# EasyEDA Pro project FKM3.epro, schematic FKM-standard

## Sheets
1 Main: Board Name: FKM; Create Date: 2024-11-17; Page Name: Main; Project Name: fkm3; Schematic Name: FKM-standard; Update Date: 2025-02-15; Company: EasyEDA.com; Drawn: EasyEDA; Page Size: A4; Part Number: JLCPCB-002; Reviewed: EasyEDA; Version: V3.0
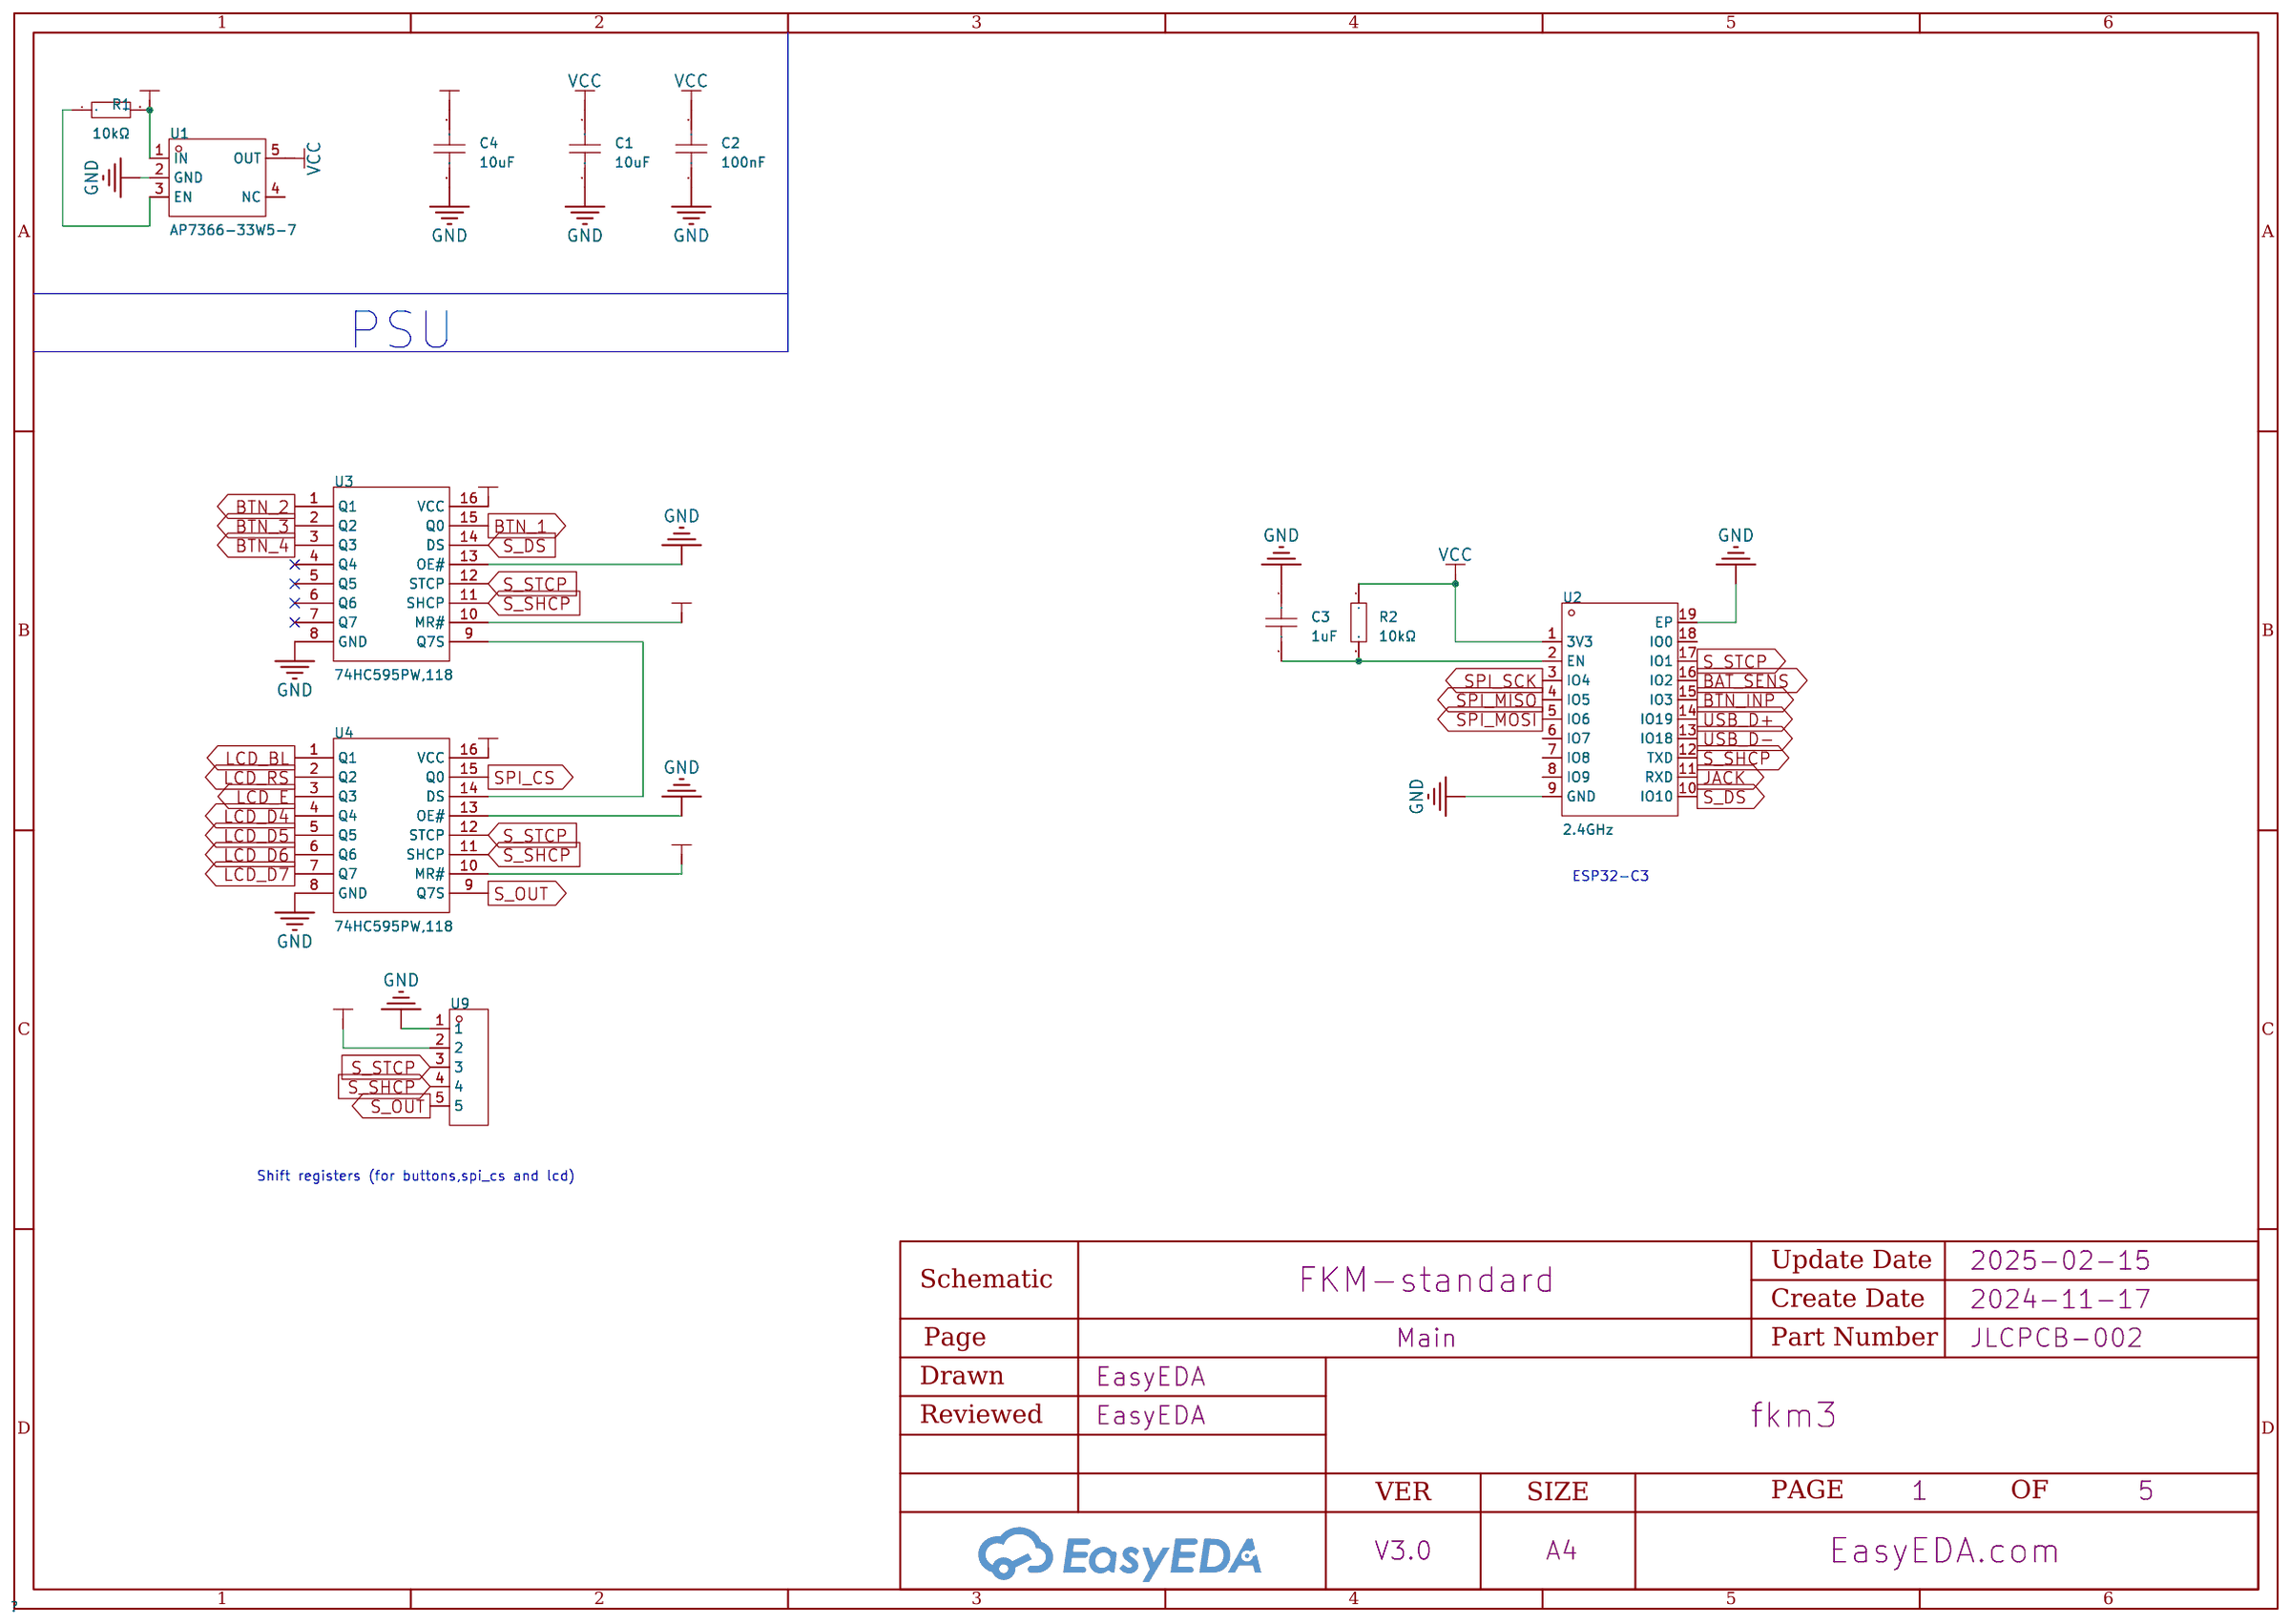
[diagram p3: Main]
2 Peripherals: Create Date: 2024-12-11; Page Name: Peripherals; Version: V0.1
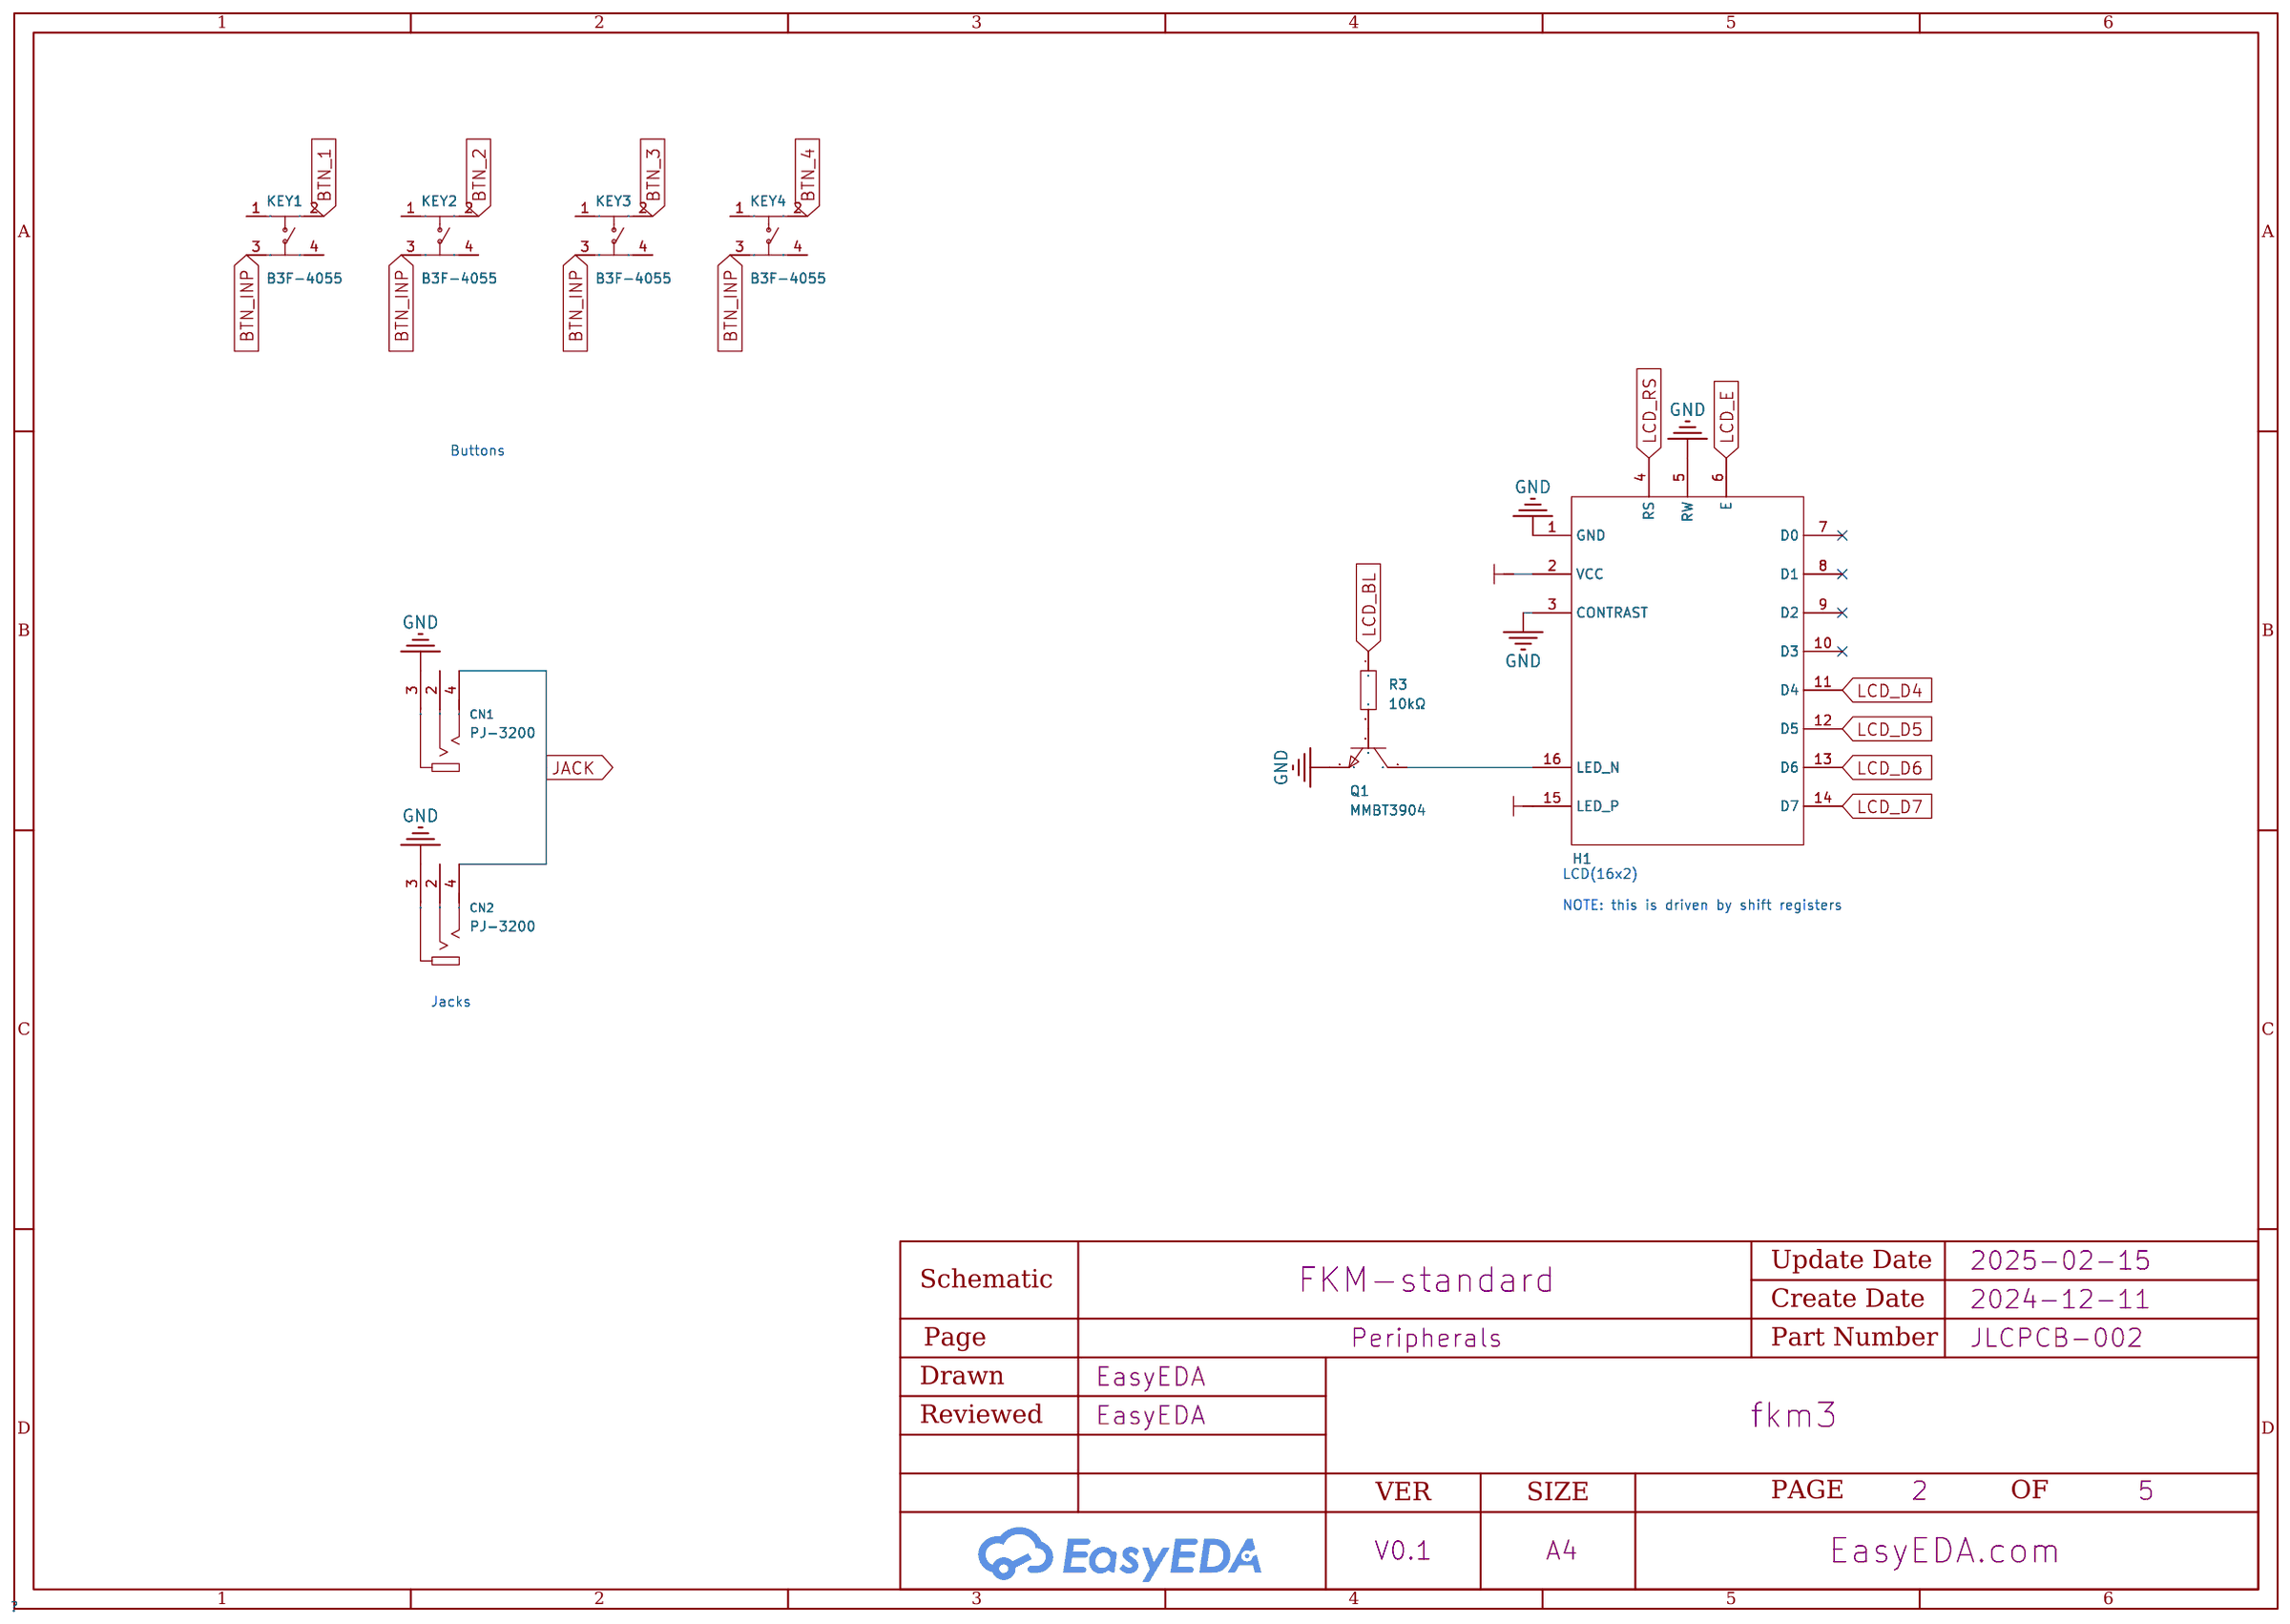
[diagram p4: Peripherals]
3 Charger: Create Date: 2025-01-28; Page Name: Charger; Update Date: 2025-07-09; Version: V0.1
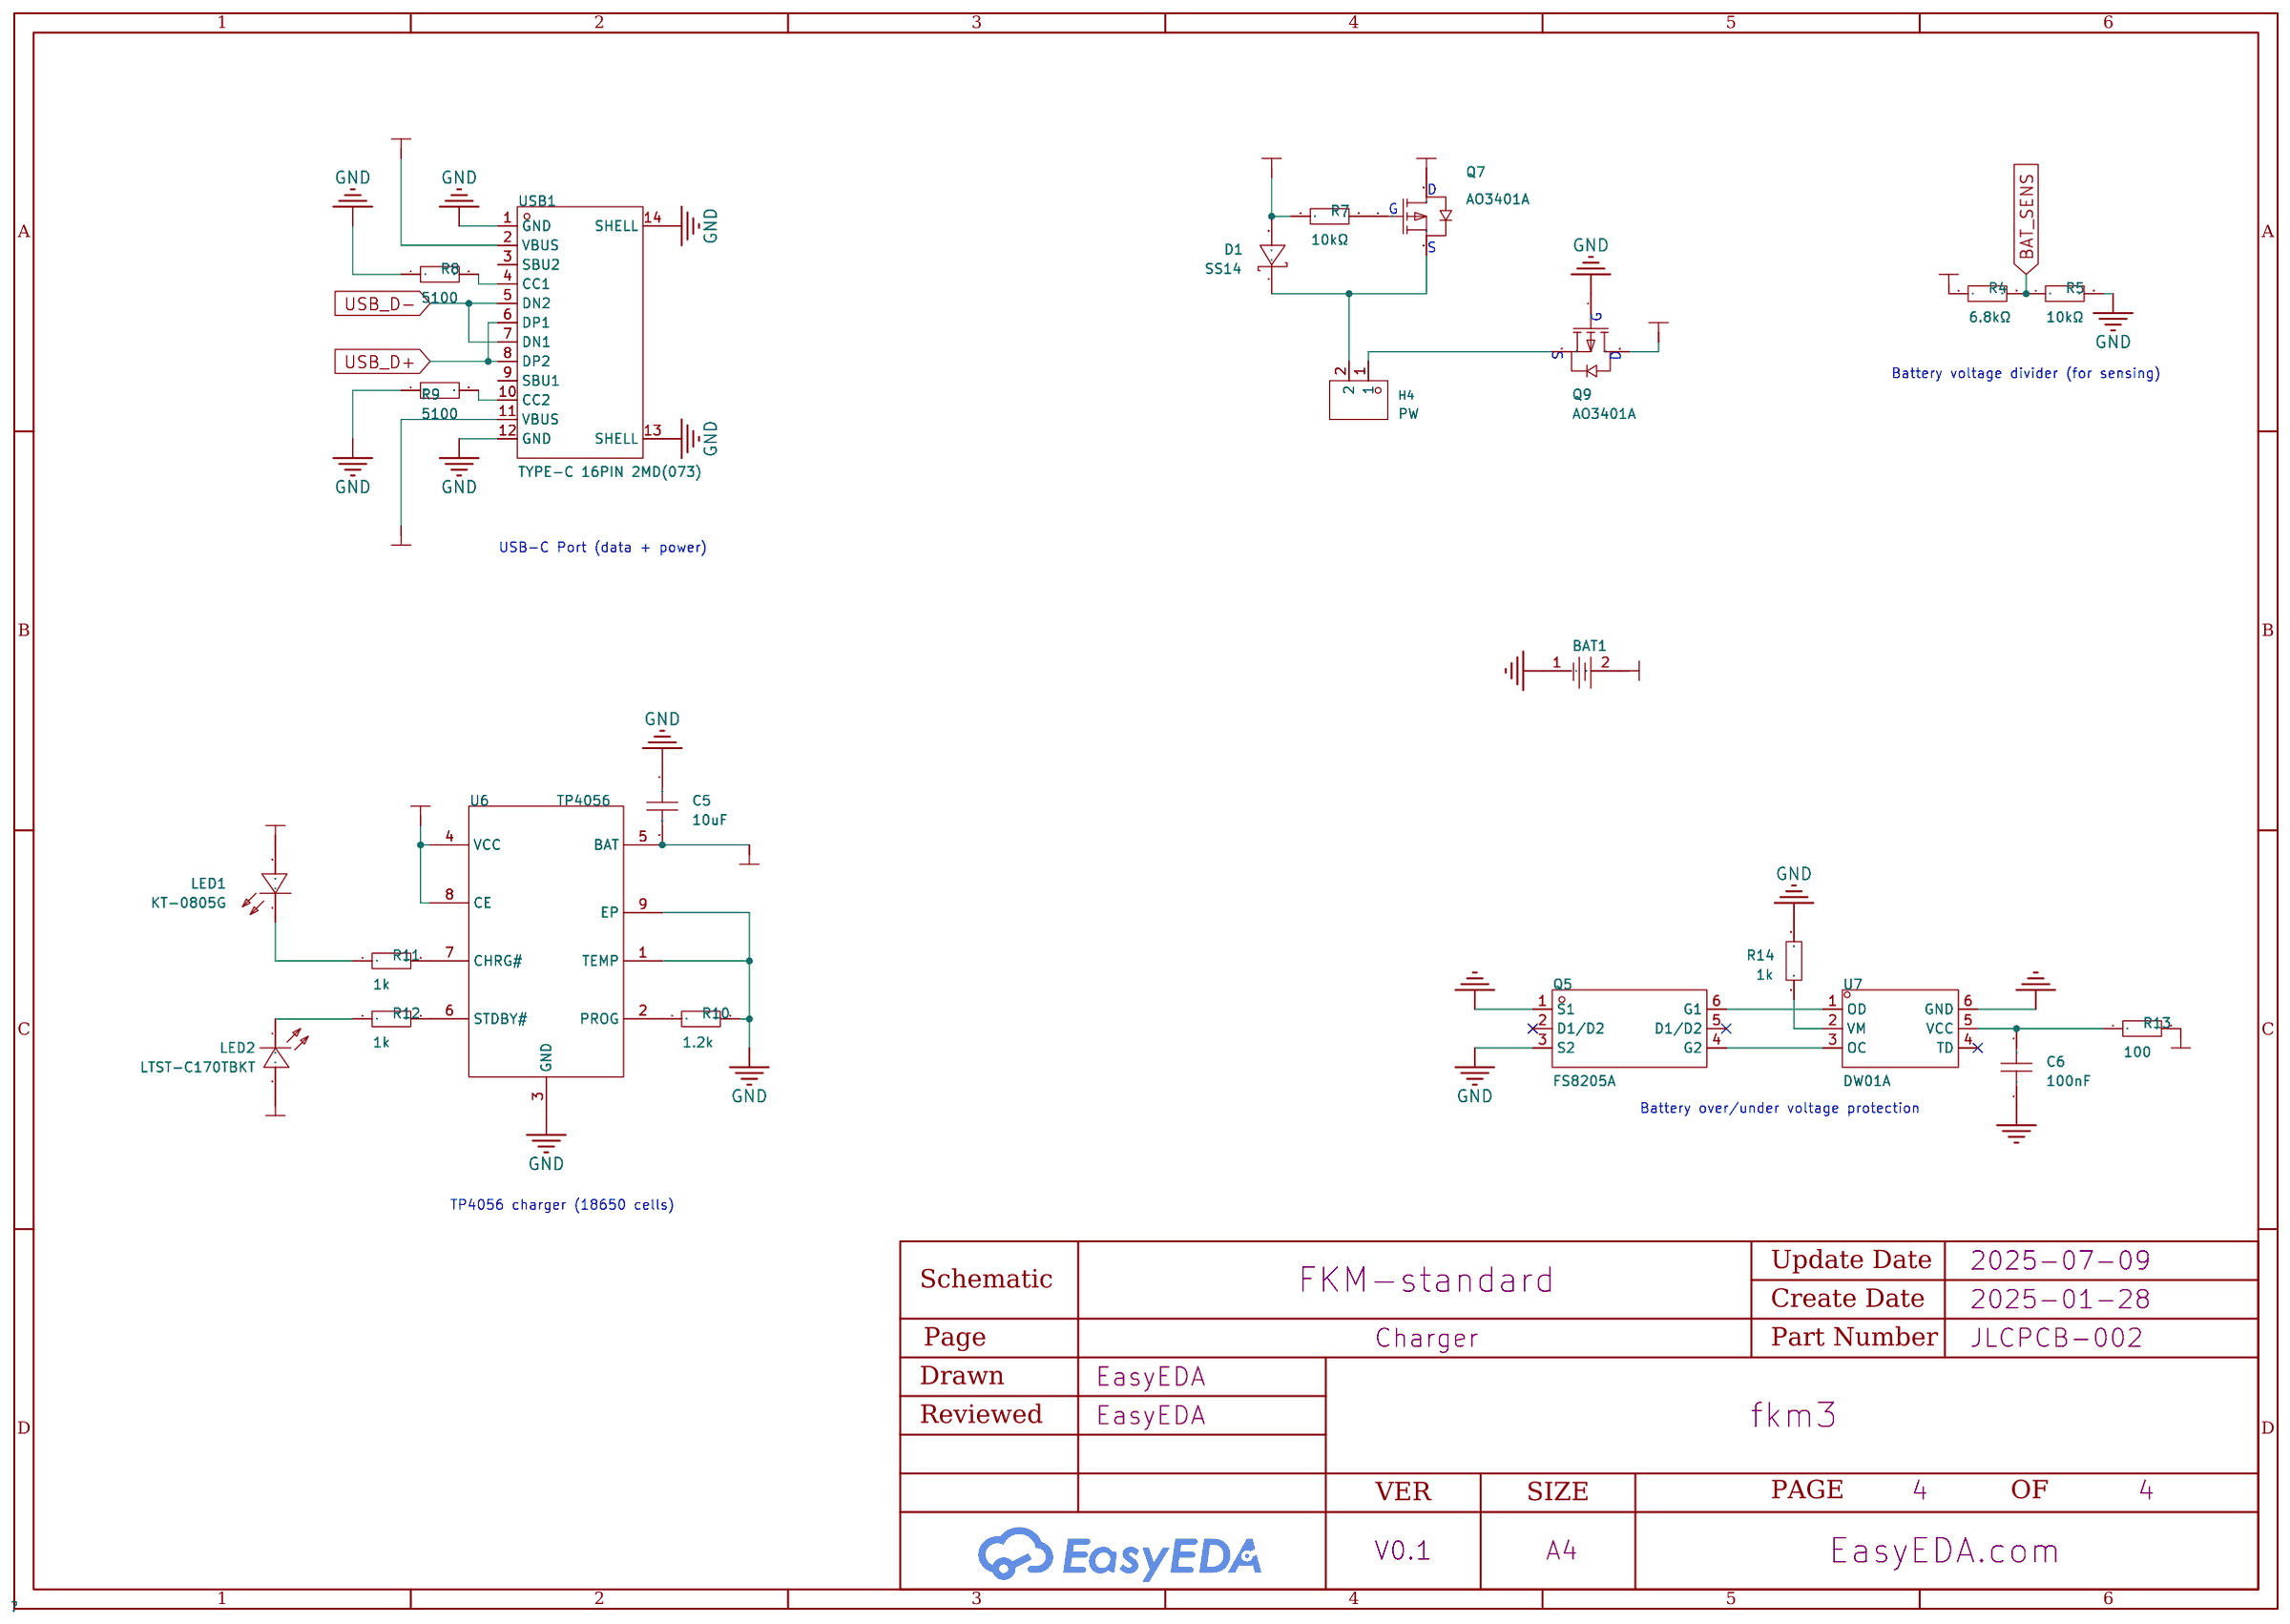
[diagram p5: Charger]
4 RFID: Create Date: 2025-07-08; Page Name: RFID; Update Date: 2025-07-08; Version: V0.1
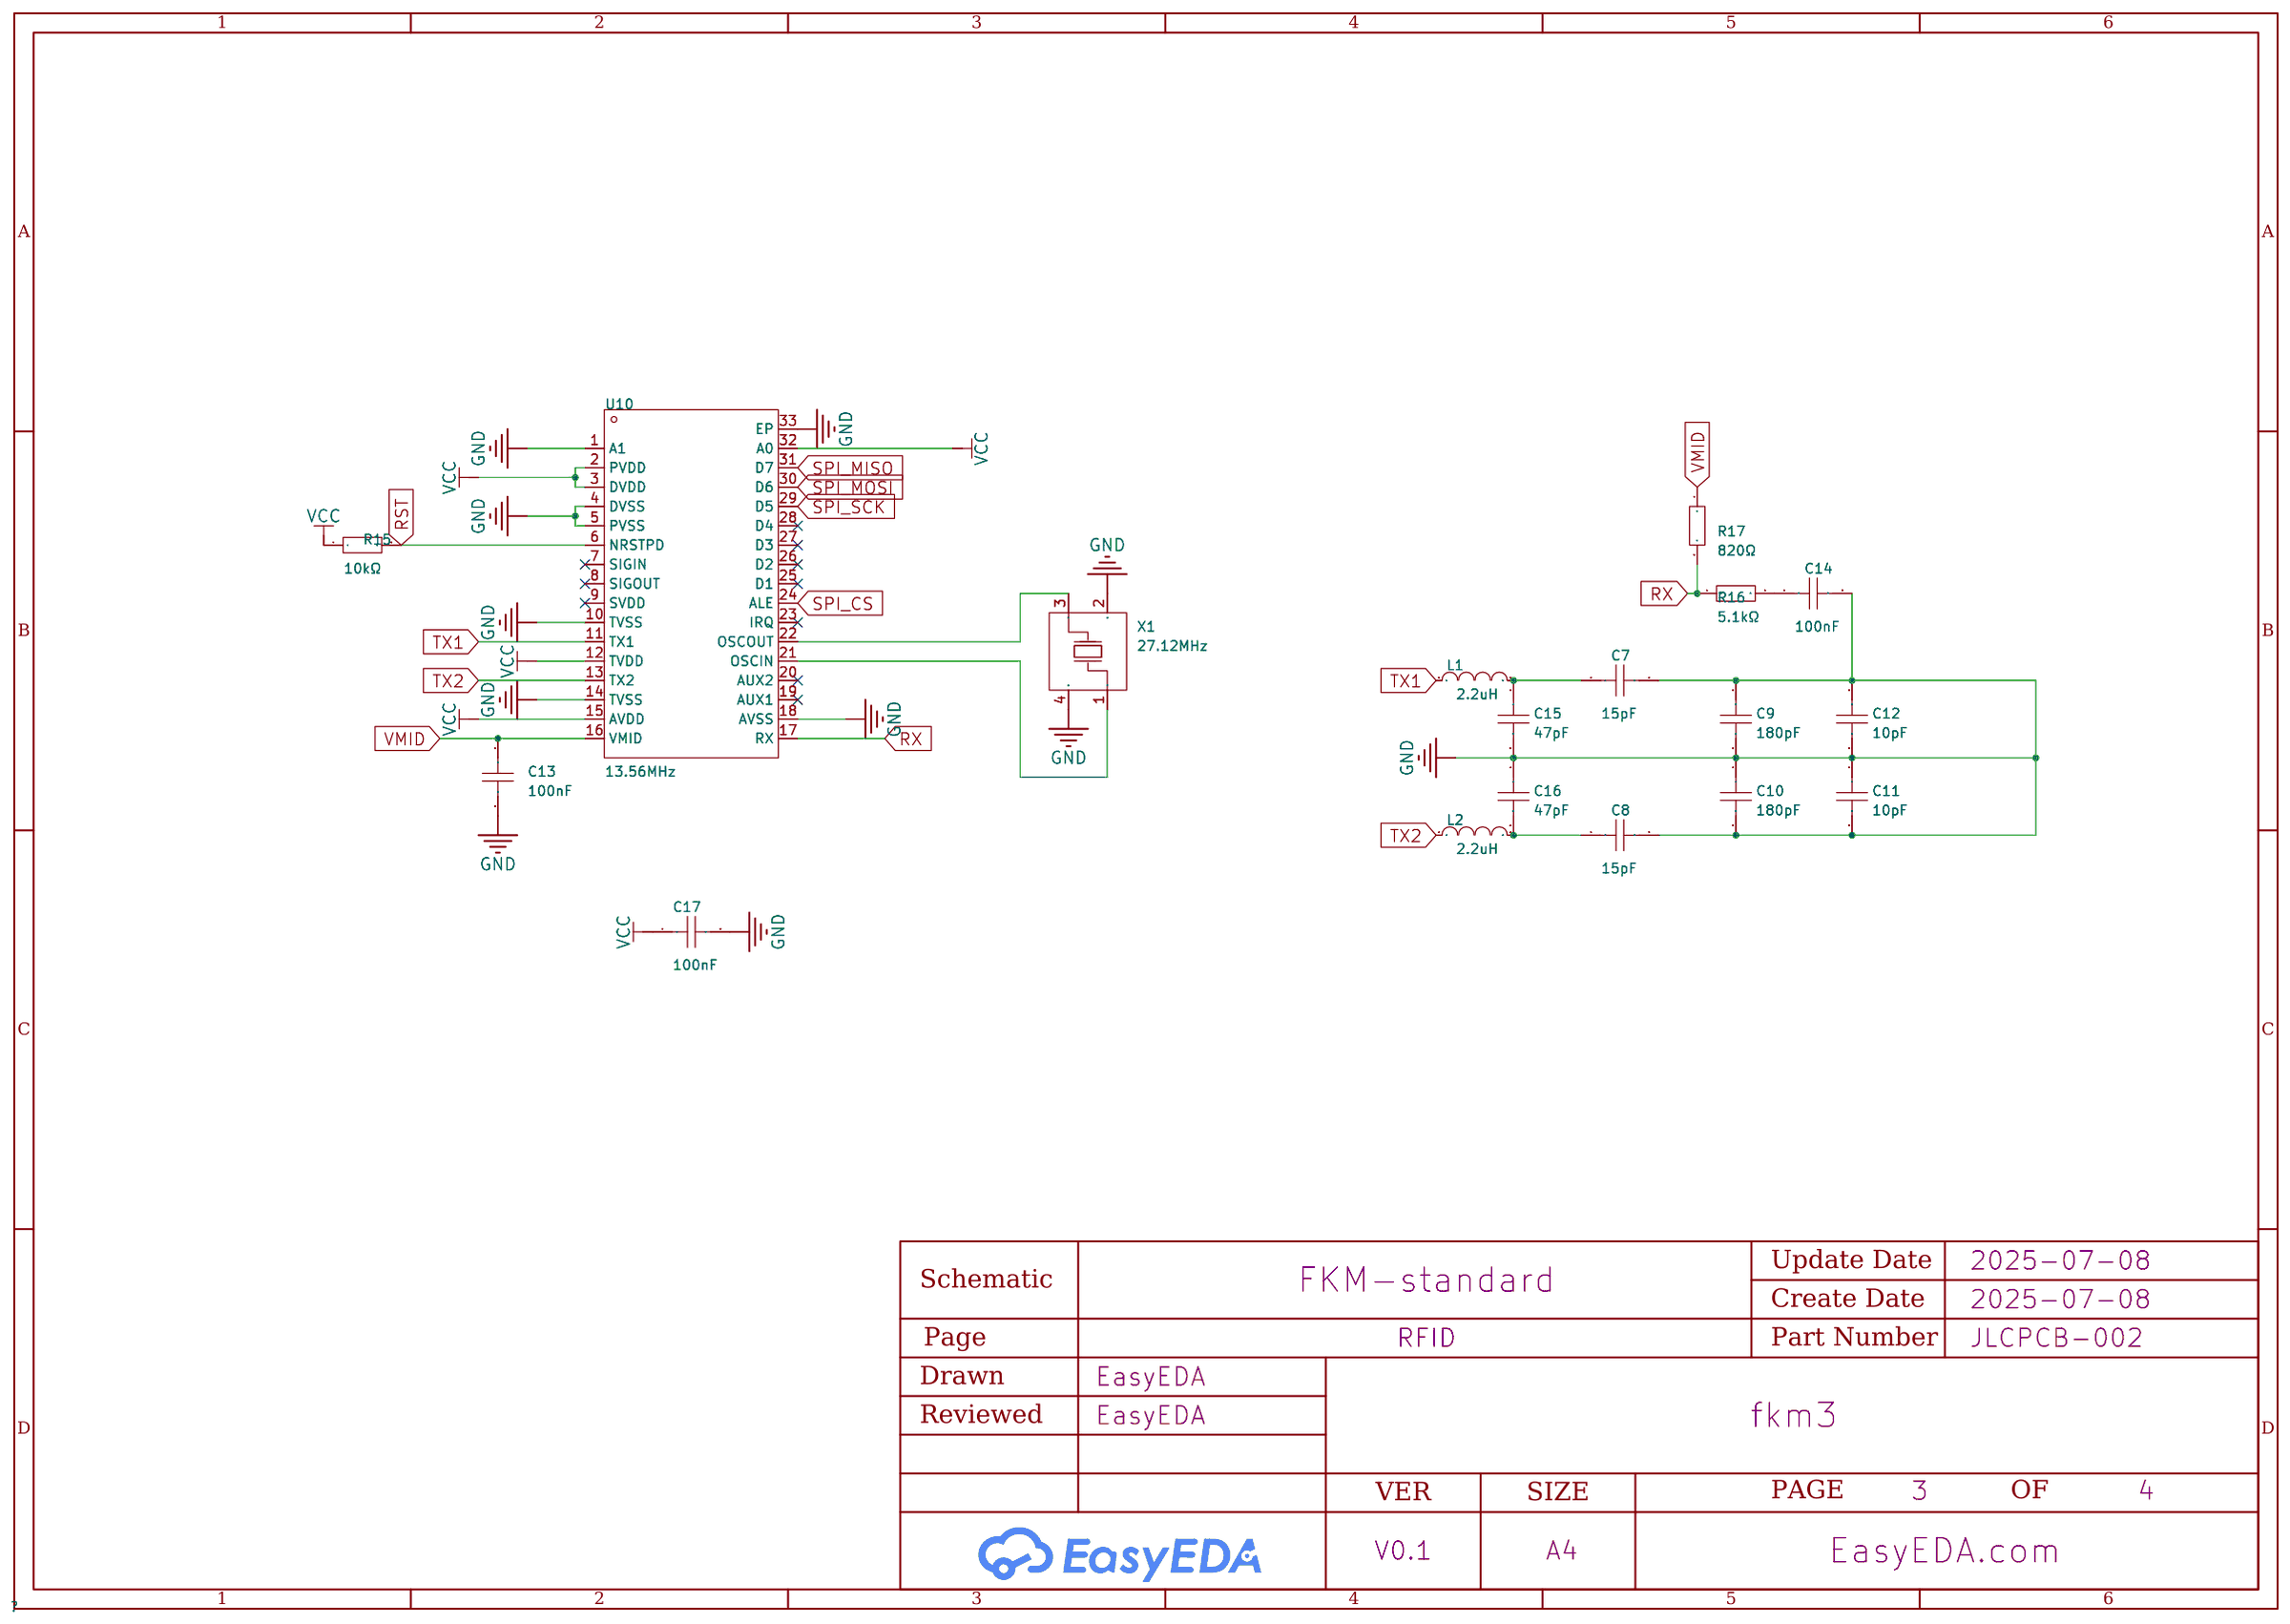
[diagram p6: RFID]

## Parts
sheet Charger
BAT1  BH-18650-A6AJ003  [BAT-TH_BH-18650-A5BJ003]
C5  10uF  [C0603]
C6  100nF  [C0603]
D1  SS14  [SMA_L4.2-W2.6-LS5.3-RD]
H4  PW  [HDR-TH_2P-P2.54-V-M]
LED1  KT-0805G  [LED0805-R-RD]
LED2  LTST-C170TBKT  [LED0805-RD_BLUE]
Q5  FS8205A  [SOT-23-6_L2.9-W1.6-P0.95-LS2.8-BR]
Q7  AO3401A  [SOT-23_L2.9-W1.3-P1.90-LS2.4-BR]
Q9  AO3401A  [SOT-23_L2.9-W1.3-P1.90-LS2.4-BR]
R4  6.8kΩ  [R0402]
R5  10kΩ  [R0805]
R7  10kΩ  [R0805]
R8  5100  [R0603]
R9  5100  [R0603]
R10  1.2k  [R0603]
R11  1k  [R0603]
R12  1k  [R0603]
R13  100  [R0603]
R14  1k  [R0603]
U6  TP4056  [ESOP-8_L4.9-W3.9-P1.27-LS6.0-BL-EP]
U7  DW01A  [SOT-23-6_L2.9-W1.6-P0.95-LS2.8-BL]
USB1  TYPE-C 16PIN 2MD(073)  [USB-C-SMD_TYPE-C-6PIN-2MD-073]
sheet Main
C1  10uF  [C0603]
C2  100nF  [C0603]
C3  1uF  [C0603]
C4  10uF  [C0603]
R1  10kΩ  [R0805]
R2  10kΩ  [R0805]
U1  AP7366-33W5-7  [SOT-25_L3.0-W1.6-P0.95-LS2.8-BL]
U2  2.4GHz  [BULETM-SMD_ESPRESSIF_ESP32-C3-WROOM-02-N4-4MB]
U3  74HC595PW,118  [TSSOP-16_L5.0-W4.4-P0.65-LS6.4-BL]
U4  74HC595PW,118  [TSSOP-16_L5.0-W4.4-P0.65-LS6.4-BL]
U9  HB-PH3-25415PB2GOP  [HDR-TH_5P-P2.54-V-M]
sheet Peripherals
CN1  PJ-3200  [AUDIO-TH_PJ-3200]
CN2  PJ-3200  [AUDIO-TH_PJ-3200]
H1  -  [LCD16x2 edge connector]  (no BOM)
KEY1  B3F-4055  [KEY-TH_4P-L12.0-W12.0-P5.00-LS13.4-EH]
KEY2  B3F-4055  [KEY-TH_4P-L12.0-W12.0-P5.00-LS13.4-EH]
KEY3  B3F-4055  [KEY-TH_4P-L12.0-W12.0-P5.00-LS13.4-EH]
KEY4  B3F-4055  [KEY-TH_4P-L12.0-W12.0-P5.00-LS13.4-EH]
Q1  MMBT3904  [SOT-23-3_L2.9-W1.3-P1.90-LS2.4-BR]
R3  10kΩ  [R0805]
sheet RFID
C7  15pF  [C0603]
C8  15pF  [C0603]
C9  180pF  [C0603]
C10  180pF  [C0603]
C11  10pF  [C0603]
C12  10pF  [C0603]
C13  100nF  [C0603]
C14  100nF  [C0603]
C15  47pF  [C0603]
C16  47pF  [C0603]
C17  100nF  [C0603]
L1  2.2uH  [L0603]
L2  2.2uH  [L0603]
R15  10kΩ  [R0805]
R16  5.1kΩ  [R0603]
R17  820Ω  [R0603]
U10  13.56MHz  [QFN-32_L5.0-W5.0-P0.50-TL-EP3.1]
X1  27.12MHz  [CRYSTAL-SMD_4P-L3.2-W2.5-BL]

## Library data of the parts
BAT1 = BH-18650-A6AJ003: Battery Type:- Contact Material:Stainless Steel Contact Plating:Nickel Operating Temperature Range:-25℃~+85℃ Operating Temperature Range:-25℃~+85℃; Supplier Part: C5371778; Manufacturer: MYOUNG(美阳); JLCPCB Part Class: Extended Part; Datasheet: https://atta.szlcsc.com/upload/public/pdf/source/20231218/F59CE24993943D35EA131B0A1D7CE933.pdf; Supplier: LCSC; Contact Material: Stainless Steel; Contact Plating: Nickel; Operating Temperature Range: -25℃~+85℃
C5 = CAP_0603: Supplier Footprint: 0603
C2 C6 C13 C14 C17 = CC0603KRX7R9BB104: Capacitance: Tolerance:±10% Tolerance:±10% Voltage Rated: Temperature Coefficient:; LCSC Part Name: 100nF ±10% 50V; Supplier Part: C14663; Manufacturer: YAGEO(国巨); Supplier Footprint: 0603; JLCPCB Part Class: Basic Part; Datasheet: https://atta.szlcsc.com/upload/public/pdf/source/20180910/C282072_33301C7F631E79921B82A8DAC6BCC5B3.pdf; Supplier: LCSC; Tolerance: ±10%; Check: true
D1 = SS14_C2480: Diode Configuration:Independent Type Forward Voltage (Vf@If):550mV@1A Reverse Voltage (Vr):40V Rectified Current:1A Reverse Leakage Current (Ir):300uA@40V; LCSC Part Name: 电压:40V 电流:1A; Supplier Part: C2480; Manufacturer: MDD(辰达半导体); Supplier Footprint: SMA(DO-214AC); JLCPCB Part Class: Basic Part; Datasheet: https://atta.szlcsc.com/upload/public/pdf/source/20240710/EF24798823EE33D63F154ED67BAC5E71.pdf; Supplier: LCSC; Diode Configuration: Independent Type; Forward Voltage (Vf@If): 550mV@1A; Reverse Voltage (Vr): 40V; Rectified Current: 1A; Reverse Leakage Current (Ir): 300uA@40V
H4 = PZ254V-11-02P: Pin Structure:1x2P Pitch:2.54mm Row Spacing:- Circluar Pins/Square Pins:Square Pins Mounting Type:Straight Number of Rows:Plugin Number of Pins:2P Current Rating (Max):- Voltage Rating (Max):- Length of Mating Pin:6mm Insulation Height:2.5mm Length of End; LCSC Part Name: 间距:2.54mm 1x2P 直插 方针; Supplier Part: C492401; Manufacturer: XFCN(兴飞); Supplier Footprint: 插件,P=2.54mm; JLCPCB Part Class: Extended Part; Datasheet: https://atta.szlcsc.com/upload/public/pdf/source/20200309/C492401_A812433581A9B211A7FFA413ADDFF0E5.pdf; Supplier: LCSC; Pin Structure: 1x2P; Pitch: 2.54mm; Circluar Pins/Square Pins: Square Pins; Mounting Type: Straight; Number of Rows: Plugin; Number of Pins: 2P; Length of Mating Pin: 6mm; Insulation Height: 2.5mm; Length of End Connection Pin: 3mm; Operating Temperature Range: -40℃~+105℃; Color: Black
LED1 = KT-0805G: Lamp Holder Type:- Emitted Color:Emerald Forward Voltage (VF):- Forward Voltage (VF):- Power Dissipation:- Forward Current:- Dominant Wavelength:- Dominant Wavelength:- Peak Wavelength:- Diode Configuration:- Lens Color:- Color Temperature:- Color Tempera; LCSC Part Name: 0805 翠绿 高亮; Supplier Part: C2297; Manufacturer: KENTO; Supplier Footprint: 0805; JLCPCB Part Class: Basic Part; Datasheet: https://atta.szlcsc.com/upload/public/pdf/source/20170209/1486607340485.pdf; Supplier: LCSC; Emitted Color: Emerald
LED2 = LTST-C170TBKT: Emitted Color:Blue Forward Voltage (VF):3.3V Forward Voltage (VF):3.3V Power Dissipation:76mW Forward Current:20mA Dominant Wavelength:465nm~475nm Dominant Wavelength:465nm~475nm Peak Wavelength:468nm Diode Configuration:- Lens Color:Colorless Transparent; LCSC Part Name: 蓝灯; Supplier Part: C98222; Manufacturer: LITEON(光宝); Supplier Footprint: 0805; JLCPCB Part Class: Extended Part; Datasheet: https://atta.szlcsc.com/upload/public/pdf/source/20171026/C98222_15089842934011059296.pdf; Supplier: LCSC; Emitted Color: Blue; Forward Voltage (VF): 3.3V; Power Dissipation: 76mW; Forward Current: 20mA; Dominant Wavelength: 465nm~475nm; Peak Wavelength: 468nm; Lens Color: Colorless Transparent Lens; Luminous Intensity: 104mcd; Viewing Angle: 130°; Operating Temperature: -20℃~+80℃
Q5 = FS8205A_C908265: Type:2 N-Channel Drain Source Voltage (Vdss): Continuous Drain Current (Id): Power Dissipation (Pd): Drain Source On Resistance (RDS(on)@Vgs,Id):18mΩ@4.5V,6A Gate Threshold Voltage (Vgs(th)@Id):1.2V@250uA Total Gate Charge (Qg@Vgs):11nC@4.5V Input Capacit; LCSC Part Name: 2个N沟道 耐压:20V 电流:6A; Supplier Part: C908265; Manufacturer: FUXINSEMI(富芯森美); Supplier Footprint: SOT-23-6L; JLCPCB Part Class: Extended Part; Datasheet: https://atta.szlcsc.com/upload/public/pdf/source/20201027/C908265_C6F1A5E0FB14735EF799FEF607A99450.pdf; Supplier: LCSC; Type: 2 N-Channel; Drain Source On Resistance (RDS(on)@Vgs,Id): 18mΩ@4.5V,6A; Gate Threshold Voltage (Vgs(th)@Id): 1.2V@250uA; Total Gate Charge (Qg@Vgs): 11nC@4.5V; Input Capacitance (Ciss@Vds): 800pF@8V; Reverse Transfer Capacitance (Crss@Vds): 125pF@8V; Operating Temperature: -55℃~+150℃@(Tj)
Q7 Q9 = AO3401A_C15127: Type:1 Piece P-Channel Drain Source Voltage (Vdss): Continuous Drain Current (Id): Drain Source On Resistance (RDS(on)@Vgs,Id):44mΩ@10V,4.3A Power Dissipation (Pd): Gate Threshold Voltage (Vgs(th)@Id):1.3V@250uA Total Gate Charge (Qg@Vgs):12.2nC@4.5V Inpu; LCSC Part Name: 1个P沟道 耐压:30V 电流:4A; Supplier Part: C15127; Manufacturer: AOS; Supplier Footprint: SOT-23; JLCPCB Part Class: Basic Part; Datasheet: https://atta.szlcsc.com/upload/public/pdf/source/20160507/1462613609053.pdf; Supplier: LCSC; Type: 1 Piece P-Channel; Drain Source On Resistance (RDS(on)@Vgs,Id): 44mΩ@10V,4.3A; Gate Threshold Voltage (Vgs(th)@Id): 1.3V@250uA; Total Gate Charge (Qg@Vgs): 12.2nC@4.5V; Input Capacitance (Ciss@Vds): 1.2nF@15V; Operating Temperature: -55℃~+150℃@(Tj)
R4 = RMC04026.8K1%N: Resistance: Tolerance:±1% Tolerance:±1% Power(Watts):; LCSC Part Name: 6.8kΩ ±1% 62.5mW; Supplier Part: C325522; Manufacturer: Tyohm(幸亚电阻); Supplier Footprint: 0402; JLCPCB Part Class: Extended Part; Datasheet: https://atta.szlcsc.com/upload/public/pdf/source/20190115/C325956_D27151D492FFB3C9AB4A6F14FE01F30A.pdf; Supplier: LCSC; Tolerance: ±1%; Check: true
R1-R3 R5 R7 R15 = SCR0805F10K: Type:Thick Film Resistors Resistance: Tolerance:±1% Tolerance:±1% Power(Watts): Overload Voltage (Max): Operating Temperature Range:-55℃~+155℃ Operating Temperature Range:-55℃~+155℃; LCSC Part Name: 厚膜电阻 10kΩ ±1% 125mW; Supplier Part: C3016734; Manufacturer: VO(翔胜); Supplier Footprint: 0805; JLCPCB Part Class: Extended Part; Datasheet: https://atta.szlcsc.com/upload/public/pdf/source/20220513/247AF9639BA21CF93567DC289CCC6A22.pdf; Supplier: LCSC; Type: Thick Film Resistors; Tolerance: ±1%; Operating Temperature Range: -55℃~+155℃; Check: true
R8-R14 = Res_0603: Supplier Footprint: 0603
U6 = TP4056-42-ESOP8: Supplier Part: C16581; Manufacturer: TOPPOWER(南京拓微); Supplier Footprint: ESOP-8; JLCPCB Part Class: Extended Part; Datasheet: https://atta.szlcsc.com/upload/public/pdf/source/20190626/C16581_611BCF5D7CF554EAE465137A8F68DB3E.pdf; Supplier: LCSC
U7 = DW01A_C351410: Supplier Part: C351410; Manufacturer: PUOLOP(迪浦); Supplier Footprint: SOT-23-6L; JLCPCB Part Class: Extended Part; Datasheet: https://atta.szlcsc.com/upload/public/pdf/source/20190109/C351410_3E9B9491D1909DF24C48D1B9CD871392.pdf; Supplier: LCSC
USB1 = TYPE-C 16PIN 2MD(073): Connector Type:Type-C Standard:USB 3.1 Gender:Female Mounting Style:Horizontal attachment Number of Contacts:16P Number of Ports:1 Current Rating - Power (Max):5A Operating Temperature Range:-25℃~+85℃ Operating Temperature Range:-25℃~+85℃ Rated Voltage (M; LCSC Part Name: Type-C 母 卧贴; Supplier Part: C2765186; Manufacturer: SHOU HAN(首韩); Supplier Footprint: SMD; JLCPCB Part Class: Extended Part; Datasheet: https://atta.szlcsc.com/upload/public/pdf/source/20211123/39B17C16241EAC15C5E277BDA434118E.pdf; Supplier: LCSC; Connector Type: Type-C; Standard: USB 3.1; Gender: Female; Mounting Style: Horizontal attachment; Number of Contacts: 16P; Number of Ports: 1; Current Rating - Power (Max): 5A; Operating Temperature Range: -25℃~+85℃; Rated Voltage (Max): 5V; Connect-Disconnect Life: 5000 Cuts; Core Colour: Black
C1 C4 = CL10A106MA8NRNC: Capacitance: Tolerance:±20% Tolerance:±20% Voltage Rated: Temperature Coefficient:; LCSC Part Name: 10uF ±20% 25V; Supplier Part: C96446; Manufacturer: SAMSUNG(三星); Supplier Footprint: 0603; JLCPCB Part Class: Basic Part; Datasheet: https://atta.szlcsc.com/upload/public/pdf/source/20160218/1457707763339.pdf; Supplier: LCSC; Tolerance: ±20%; Check: true
C3 = CL10A105KO8NNNC: Capacitance: Tolerance:±10% Tolerance:±10% Voltage Rated: Temperature Coefficient:; LCSC Part Name: 1uF ±10% 16V; Supplier Part: C1592; Manufacturer: SAMSUNG(三星); Supplier Footprint: 0603; JLCPCB Part Class: Extended Part; Datasheet: https://atta.szlcsc.com/upload/public/pdf/source/20220919/9FBE606BE0D9532D730F292EB26DC5BB.pdf; Supplier: LCSC; Tolerance: ±10%; Check: true
U1 = AP7366-33W5-7: Output Type:固定 Maximum Input Voltage:6V Output Voltage:3.3V Output Voltage:3.3V MAX Output Current:600mA Dropout Voltage:320mV@(600mA) standby current:80uA Operating Temperature:-40℃~+85℃@(Ta) Operating Temperature:-40℃~+85℃@(Ta) Output Polarity:Positive; Supplier Part: C526385; Manufacturer: DIODES(美台); Supplier Footprint: SOT-25; JLCPCB Part Class: Extended Part; Datasheet: https://atta.szlcsc.com/upload/public/pdf/source/20200515/C526385_78D268FE91AC13778CA0F1BF99E3B397.pdf; Supplier: LCSC; Output Type: 固定; Maximum Input Voltage: 6V; Output Voltage: 3.3V; MAX Output Current: 600mA; Dropout Voltage: 320mV@(600mA); standby current: 80uA; Operating Temperature: -40℃~+85℃@(Ta); Output Polarity: Positive electrode; Number of Outputs: 1
U2 = ESP32-C3-WROOM-02-N4_C2934560: Core Processor:ESP32-C3芯片 Support Interface:I2C；GPIO；SPI；JTAG；UART；USB；I2S Frequency:2.4GHz Output Power:20.5dBm Output Power:20.5dBm; LCSC Part Name: ESP32-C3-WROOM-02-N4; Supplier Part: C2934560; Manufacturer: ESPRESSIF(乐鑫); Manufacturer Part: ESP32-C3-WROOM-02-N4; Supplier Footprint: VFQFN-32-EP; JLCPCB Part Class: Extended Part; Datasheet: https://atta.szlcsc.com/upload/public/pdf/source/20220106/F07459EFFE1D7CBA94B4FB8A075146A6.pdf; Supplier: LCSC; Core Processor: ESP32-C3芯片; Support Interface: I2C；GPIO；SPI；JTAG；UART；USB；I2S; Output Power: 20.5dBm; Check: true
U3 U4 = 74HC595PW,118: Function:串行至串行或并行 Supply Voltage:2V~6V Supply Voltage:2V~6V Number of Elements:1 Number of Bits per Element:8 Output Type:Tri-State Series: Operating Temperature:-40℃~+125℃ Operating Temperature:-40℃~+125℃; LCSC Part Name: 三态输出 串行至串行或并行移位寄存器; Supplier Part: C5948; Manufacturer: Nexperia(安世); Supplier Footprint: TSSOP-16; JLCPCB Part Class: Extended Part; Datasheet: https://atta.szlcsc.com/upload/public/pdf/source/20180913/C282339_0D5CAAE223E9DCA510F4DD24C6ACF74D.pdf; Supplier: LCSC; Function: 串行至串行或并行; Supply Voltage: 2V~6V; Number of Elements: 1; Number of Bits per Element: 8; Output Type: Tri-State; Operating Temperature: -40℃~+125℃; Check: true
U9 = HB-PH3-25415PB2GOP: Pin Structure:1x5P Pitch:2.54mm Row Spacing:2.54mm Circluar Pins/Square Pins:Square Pins Mounting Type:Straight Number of Rows:Plugin Number of Pins:5P Current Rating (Max):3A Voltage Rating (Max):250V Length of Mating Pin:6mm Insulation Height:2.54mm Len; LCSC Part Name: 间距:2.54mm 1x5P 直插 方针; Supplier Part: C6332198; Manufacturer: HANBO(汉博); Supplier Footprint: 插件,P=2.54mm; JLCPCB Part Class: Extended Part; Datasheet: https://atta.szlcsc.com/upload/public/pdf/source/20230803/F72D259687963761DF1B552F3BB84A31.pdf; Supplier: LCSC; Pin Structure: 1x5P; Pitch: 2.54mm; Row Spacing: 2.54mm; Circluar Pins/Square Pins: Square Pins; Mounting Type: Straight; Number of Rows: Plugin; Number of Pins: 5P; Current Rating (Max): 3A; Voltage Rating (Max): 250V; Length of Mating Pin: 6mm; Insulation Height: 2.54mm; Length of End Connection Pin: 3mm; Contact Plating: Gold; Operating Temperature Range: -40℃~+105℃; Soldering Temperature(Max): 260℃; Color: Black
CN1 CN2 = PJ-3200: Connector Type:3.5mm耳机座 Current Rating (Max):500mA Voltage Rating (Max):30V Operating Temperature Range:-20℃~+70℃ Operating Temperature Range:-20℃~+70℃ Soldering Temperature(Max):235℃; LCSC Part Name: 3.5mm耳机座; Supplier Part: C2689690; Manufacturer: XKB Connectivity(中国星坤); Supplier Footprint: 插件; JLCPCB Part Class: Extended Part; Datasheet: https://atta.szlcsc.com/upload/public/pdf/source/20211011/0B1C3F8D3B14DEB4B55195420484A083.pdf; Supplier: LCSC; Connector Type: 3.5mm耳机座; Current Rating (Max): 500mA; Voltage Rating (Max): 30V; Operating Temperature Range: -20℃~+70℃; Soldering Temperature(Max): 235℃
H1 = LCD16x2 edge connector
KEY1-KEY4 = B3F-4055_C84931: Circuit:SPST Actuator Style:Rectangle button Mounting Style:Direct Insert Switch Length:12mm Switch Width:12mm Switch Height:7.3mm Contact Current:50mA Voltage Rating (DC):24V With Lamp:- Mechanical Life:-; LCSC Part Name: 12*12*7.3mm 直插 轻触开关; Supplier Part: C84931; Manufacturer: OMRON(欧姆龙); Supplier Footprint: 插件; JLCPCB Part Class: Extended Part; Datasheet: https://atta.szlcsc.com/upload/public/pdf/source/20170810/C93157_1502335414592880008.pdf; Supplier: LCSC; Circuit: SPST; Actuator Style: Rectangle button; Mounting Style: Direct Insert; Switch Length: 12mm; Switch Width: 12mm; Switch Height: 7.3mm; Contact Current: 50mA; Voltage Rating (DC): 24V; Check: true
Q1 = MMBT3904_C20526: Transistor Type: Collector Current (Ic): Collector-Emitter Breakdown Voltage (Vceo): Power Dissipation (Pd): DC Current Gain (hFE@Ic,Vce):100@10mA,1V DC Current Gain (hFE@Ic,Vce):100@10mA,1V Transition Frequency (fT):300MHz Collector Cut-Off Current (Icbo; LCSC Part Name: MMBT3904(RANGE:100-300) hfe=100~300; Supplier Part: C20526; Manufacturer: CJ(江苏长电/长晶); Supplier Footprint: SOT-23; JLCPCB Part Class: Basic Part; Datasheet: https://atta.szlcsc.com/upload/public/pdf/source/20220704/70F575FB75061E03F919270A6BB8BA7F.pdf; Supplier: LCSC; DC Current Gain (hFE@Ic,Vce): 100@10mA,1V; Transition Frequency (fT): 300MHz; Collector Cut-Off Current (Icbo): 100nA; Collector-Emitter Saturation Voltage (VCE(sat)@Ic,Ib): 300mV@50mA,5mA; Check: true
C7 C8 = CC0603JRNPO9BN150: Capacitance: Tolerance:±5% Tolerance:±5% Voltage Rated: Temperature Coefficient:; LCSC Part Name: 15pF ±5% 50V; Supplier Part: C107037; Manufacturer: YAGEO(国巨); Supplier Footprint: 0603; JLCPCB Part Class: Extended Part; Datasheet: https://atta.szlcsc.com/upload/public/pdf/source/20170914/C128857_1505359892143968080.pdf; Supplier: LCSC; Tolerance: ±5%
C9 C10 = CC0603JRNPO9BN181: Capacitance: Tolerance:±5% Tolerance:±5% Voltage Rated: Temperature Coefficient:; LCSC Part Name: 180pF ±5% 50V; Supplier Part: C107041; Manufacturer: YAGEO(国巨); Supplier Footprint: 0603; JLCPCB Part Class: Extended Part; Datasheet: https://atta.szlcsc.com/upload/public/pdf/source/20170914/C128857_1505359892143968080.pdf; Supplier: LCSC; Tolerance: ±5%
C11 C12 = CC0603JRNPO9BN100: Capacitance: Tolerance:±5% Tolerance:±5% Voltage Rated: Temperature Coefficient:; LCSC Part Name: 10pF ±5% 50V; Supplier Part: C106245; Manufacturer: YAGEO(国巨); Supplier Footprint: 0603; JLCPCB Part Class: Extended Part; Datasheet: https://atta.szlcsc.com/upload/public/pdf/source/20170505/1493957838062.pdf; Supplier: LCSC; Tolerance: ±5%
C15 C16 = CC0603JRNPO9BN470: Capacitance: Tolerance:±5% Tolerance:±5% Voltage Rated: Temperature Coefficient:; LCSC Part Name: 47pF ±5% 50V; Supplier Part: C105622; Manufacturer: YAGEO(国巨); Supplier Footprint: 0603; JLCPCB Part Class: Extended Part; Datasheet: https://atta.szlcsc.com/upload/public/pdf/source/20170505/1493957838062.pdf; Supplier: LCSC; Tolerance: ±5%
L1 L2 = LQM18PN2R2MFRL: Inductance: Tolerance:±20% Tolerance:±20% Rated Current: Saturation Current (Isat):- DC Resistance (DCR): Q @ Freq:- Frequency - Self Resonant: Ratings:; LCSC Part Name: 2.2uH ±20%; Supplier Part: C337910; Manufacturer: muRata(村田); Supplier Footprint: 0603; JLCPCB Part Class: Extended Part; Datasheet: https://atta.szlcsc.com/upload/public/pdf/source/20190301/C337910_27DA25781C95F885577870A93A746ADF.pdf; Supplier: LCSC; Tolerance: ±20%
R16 = 0603WAF5101T5E: Type:Thick Film Resistors Resistance:5.1kΩ Tolerance:±1% Tolerance:±1% Power(Watts): Overload Voltage (Max): Temperature Coefficient:±100ppm/℃ Temperature Coefficient:±100ppm/℃ Operating Temperature Range:-55℃~+155℃ Operating Temperature Range:-55℃~+155℃; LCSC Part Name: 5.1kΩ ±1% 100mW 厚膜电阻; Supplier Part: C23186; Manufacturer: UNI-ROYAL(厚声); Supplier Footprint: 0603; JLCPCB Part Class: Basic Part; Datasheet: https://atta.szlcsc.com/upload/public/pdf/source/20200306/C422600_1E6D84923E4A46A82E41ADD87F860B5C.pdf; Supplier: LCSC; Type: Thick Film Resistors; Tolerance: ±1%; Temperature Coefficient: ±100ppm/℃; Operating Temperature Range: -55℃~+155℃
R17 = FRC0603F8200TS: Type:Thick Film Resistors Resistance:820Ω Tolerance:±1% Tolerance:±1% Power(Watts):100mW Voltage-Supply(Max):75V Temperature Coefficient:±100ppm/℃ Temperature Coefficient:±100ppm/℃ Operating Temperature:-55℃~+155℃ Operating Temperature:-55℃~+155℃; LCSC Part Name: 820Ω ±1% 100mW 厚膜电阻; Supplier Part: C2907071; Manufacturer: FOJAN(富捷); Supplier Footprint: 0603; JLCPCB Part Class: Extended Part; Datasheet: https://atta.szlcsc.com/upload/public/pdf/source/20211221/925EC7D7225764EE0046F22065062C87.pdf; Supplier: LCSC; Type: Thick Film Resistors; Tolerance: ±1%; Power(Watts): 100mW; Voltage-Supply(Max): 75V; Temperature Coefficient: ±100ppm/℃; Operating Temperature: -55℃~+155℃
U10 = MFRC522: agreement:ISO 14443A；ISO 14443B interface type:I2C；UART；SPI transmission rate:9.6Kbps Frequency:13.56MHz Frequency:13.56MHz mains input:2.5V~4V mains input:2.5V~4V; LCSC Part Name: 标准3V MIFARE读卡器解决方案; Supplier Part: C2760772; Manufacturer: JSMSEMI(杰盛微); Supplier Footprint: QFN-32-EP(5x5); JLCPCB Part Class: Extended Part; Datasheet: https://atta.szlcsc.com/upload/public/pdf/source/20240328/DAD0AAAC32ED29173B34D9DCB65EF43F.pdf; Supplier: LCSC; agreement: ISO 14443A；ISO 14443B; interface type: I2C；UART；SPI; transmission rate: 9.6Kbps; mains input: 2.5V~4V
X1 = X32252712MSB4SI: Type:Surface Mount Crystal Frequency:27.12MHz Normal temperature Frequency Tolerance:±10ppm Normal temperature Frequency Tolerance:±10ppm Load Capacitance: Frequency Stability:±20ppm Frequency Stability:±20ppm Operating Temperature:-40℃~+85℃ Operating Tem; LCSC Part Name: 27.12MHz ±10ppm 20pF; Supplier Part: C70591; Manufacturer: YXC(扬兴晶振); Supplier Footprint: SMD3225-4P; JLCPCB Part Class: Extended Part; Datasheet: https://atta.szlcsc.com/upload/public/pdf/source/20240329/19D5F850207469550BEB00D7DFEDBC7A.pdf; Supplier: LCSC; Type: Surface Mount Crystal; Normal temperature Frequency Tolerance: ±10ppm; Frequency Stability: ±20ppm; Operating Temperature: -40℃~+85℃

## Nets
GND: C1.2 C2.2 C3.1 C4.2 C5.1 C7.2 C8.2 C9.1 C9.2 C10.1 C10.2 C11.1 C11.2 C12.1 C12.2 C13.2 C14.2 C15.2 C16.1 C17.2 CN1.3 CN2.3 H1.1(GND) H1.3(CONTRAST) H1.5(RW) Q1.2(E) Q5.3(S2) Q9.1(G) R5.2 R8.1 R9.1 R10.2 R14.1 U1.2(GND) U2.9(GND) U2.19(EP) U3.8(GND) U3.13(OE#) U4.8(GND) U4.13(OE#) U6.1(TEMP) U6.3(GND) U6.9(EP) U9.1 U10.1(A1) U10.4(DVSS) U10.5(PVSS) U10.10(TVSS) U10.14(TVSS) U10.18(AVSS) U10.33(EP) USB1.1(GND) USB1.12(GND) USB1.13(SHELL) USB1.14(SHELL) X1.2(GND) X1.4(GND)
VBUS: C4.1 H1.2(VCC) H1.15(LED_P) Q9.3(D) R1.2 U1.1(IN) U3.10(MR#) U3.16(VCC) U4.10(MR#) U4.16(VCC) U9.2
VCC: C1.1 C2.1 C17.1 R2.1 R15.1 U1.5(OUT) U2.1(3V3) U10.2(PVDD) U10.3(DVDD) U10.12(TVDD) U10.15(AVDD) U10.32(A0)
B+: BAT1.2 C5.2 Q7.3(D) R4.1 R13.2 U6.5(BAT)
B-: BAT1.1 C6.2 Q5.1(S1) U7.6(GND)
BAT_SENS: R4.2 R5.1 U2.16(IO2)
BTN_1: KEY1.2 U3.15(Q0)
BTN_2: KEY2.2 U3.1(Q1)
BTN_3: KEY3.2 U3.2(Q2)
BTN_4: KEY4.2 U3.3(Q3)
BTN_INP: KEY1.3 KEY2.3 KEY3.3 KEY4.3 U2.15(IO3)
JACK: CN1.4 CN2.4 U2.11(RXD)
LCD_BL: R3.1 U4.1(Q1)
LCD_D4: H1.11(D4) U4.4(Q4)
LCD_D5: H1.12(D5) U4.5(Q5)
LCD_D6: H1.13(D6) U4.6(Q6)
LCD_D7: H1.14(D7) U4.7(Q7)
LCD_E: H1.6(E) U4.3(Q3)
LCD_RS: H1.4(RS) U4.2(Q2)
RST: R15.2 U10.6(NRSTPD)
RX: R16.1 R17.2 U10.17(RX)
S_DS: U2.10(IO10) U3.14(DS)
S_OUT: U4.9(Q7S) U9.5
S_SHCP: U2.12(TXD) U3.11(SHCP) U4.11(SHCP) U9.4
S_STCP: U2.17(IO1) U3.12(STCP) U4.12(STCP) U9.3
SPI_CS: U4.15(Q0) U10.24(ALE)
SPI_MISO: U2.4(IO5) U10.31(D7)
SPI_MOSI: U2.5(IO6) U10.30(D6)
SPI_SCK: U2.3(IO4) U10.29(D5)
TX1: L1.1 U10.11(TX1)
TX2: L2.1 U10.13(TX2)
USB_D+: U2.14(IO19) USB1.6(DP1) USB1.8(DP2)
USB_D-: U2.13(IO18) USB1.5(DN2) USB1.7(DN1)
VMID: C13.1 R17.1 U10.16(VMID)
VUSB: D1.2(A) LED1.1(A) LED2.2(A) R7.1 U6.4(VCC) U6.8(CE) USB1.2(VBUS) USB1.11(VBUS)
$1N383: R1.1 U1.3(EN)
$1N953: C3.2 R2.2 U2.2(EN)
$1N7305: U3.9(Q7S) U4.14(DS)
$2N3153: Q1.1(B) R3.2
$2N3159: H1.16(LED_N) Q1.3(C)
$3N796: R9.2 USB1.10(CC2)
$3N800: R8.2 USB1.4(CC1)
$3N1470: C6.1 R13.1 U7.5(VCC)
$3N1480: R11.2 U6.7(CHRG#)
$3N1483: R12.2 U6.6(STDBY#)
$3N1491: R10.1 U6.2(PROG)
$3N1585: R14.2 U7.2(VM)
$3N1604: Q5.4(G2) U7.3(OC)
$3N1608: Q5.6(G1) U7.1(OD)
$3N3082: LED1.2(K) R11.1
$3N3173: LED2.1(K) R12.1
$3N11361: D1.1(K) H4.2 Q7.2(S)
$3N11365: H4.1 Q9.2(S)
$3N11375: Q7.1(G) R7.2
$5N1067: U10.21(OSCIN) X1.1(OSC1)
$5N1069: U10.22(OSCOUT) X1.3(OSC2)
$5N1072: C14.1 R16.2
$5N1077: C8.1 C16.2 L2.2
$5N1078: C7.1 C15.1 L1.2

Not connected (* = marked no-connect by the designer): CN1 2; CN2 2; H1 7(D0)* 8(D1)* 9(D2)* 10(D3)*; KEY1 1 4; KEY2 1 4; KEY3 1 4; KEY4 1 4; Q5 2(D1/D2)* 5(D1/D2)*; U1 4(NC); U2 6(IO7) 7(IO8) 8(IO9) 18(IO0); U3 4(Q4)* 5(Q5)* 6(Q6)* 7(Q7)*; U7 4(TD)*; U10 7(SIGIN)* 8(SIGOUT)* 9(SVDD)* 19(AUX1)* 20(AUX2)* 23(IRQ)* 25(D1)* 26(D2)* 27(D3)* 28(D4)*; USB1 3(SBU2) 9(SBU1)

## Notes on the sheets
sheet 1
- PSU
- ESP32-C3
- Shift registers (for buttons,spi_cs and lcd)
sheet 2
- Buttons
- LCD(16x2)
  NOTE: this is driven by shift registers
- Jacks
sheet 3
- D
- G
- S
- G
- S
- D
- Battery voltage divider (for sensing)
- USB-C Port (data + power)
- Battery over/under voltage protection
- TP4056 charger (18650 cells)
